# Altium schematic sheet Sheet1.SchDoc
size A3
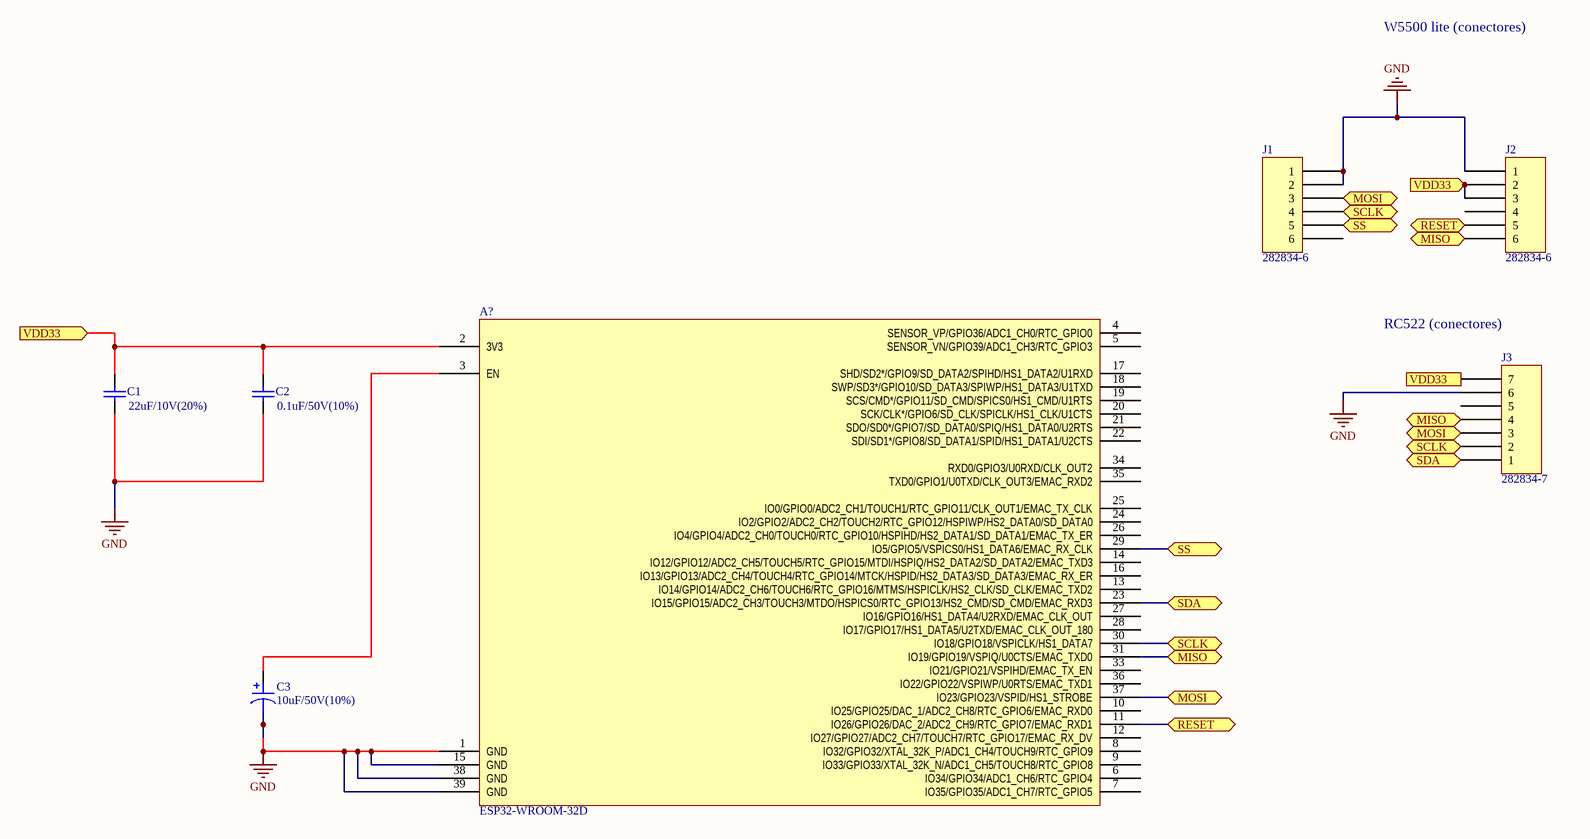
[diagram p0: Sheet1.SchDoc]

## Parts
A?  ESP32-WROOM-32D  [Espressif ESP32-WROOM-32]
C1  value 22uF/10V(20%)  [RAD-0.3]
C2  value 0.1uF/50V(10%)  [RAD-0.3]
C3  (no value)  [CAP POL 1411_3528]
J1  282834-6  [TE 282834-6]
J2  282834-6  [TE 282834-6]
J3  282834-7  [TE 282834-7]

## Ports
MISO (bidir), MOSI (bidir), RESET (bidir), SCLK (bidir), SDA (bidir), SS (bidir), VDD33 (in)

## Nets
GND: A?.1(GND) A?.15(GND) A?.38(GND) A?.39(GND) C1.1 C2.1 C3.2 J1.1 J1.2 J2.1 J3.6
MISO: A?.31(IO19/GPIO19/VSPIQ/U0CTS/EMAC_TXD0) J2.6 J3.4 ; port MISO
MOSI: A?.37(IO23/GPIO23/VSPID/HS1_STROBE) J1.3 J3.3 ; port MOSI
RESET: A?.11(IO26/GPIO26/DAC_2/ADC2_CH9/RTC_GPIO7/EMAC_RXD1) J2.5 ; port RESET
SCLK: A?.30(IO18/GPIO18/VSPICLK/HS1_DATA7) J1.4 J3.2 ; port SCLK
SDA: A?.23(IO15/GPIO15/ADC2_CH3/TOUCH3/MTDO/HSPICS0/RTC_GPIO13/HS2_CMD/SD_CMD/EMAC_RXD3) J3.1 ; port SDA
SS: A?.29(IO5/GPIO5/VSPICS0/HS1_DATA6/EMAC_RX_CLK) J1.5 ; port SS
VDD33: A?.2(3V3) C1.2 C2.2 J2.2 J2.3 J3.7 ; port VDD33
NetA?_3: A?.3(EN) C3.1

Not connected (* = marked no-connect by the designer): A? 4(SENSOR_VP/GPIO36/ADC1_CH0/RTC_GPIO0) 5(SENSOR_VN/GPIO39/ADC1_CH3/RTC_GPIO3) 6(IO34/GPIO34/ADC1_CH6/RTC_GPIO4) 7(IO35/GPIO35/ADC1_CH7/RTC_GPIO5) 8(IO32/GPIO32/XTAL_32K_P/ADC1_CH4/TOUCH9/RTC_GPIO9) 9(IO33/GPIO33/XTAL_32K_N/ADC1_CH5/TOUCH8/RTC_GPIO8) 10(IO25/GPIO25/DAC_1/ADC2_CH8/RTC_GPIO6/EMAC_RXD0) 12(IO27/GPIO27/ADC2_CH7/TOUCH7/RTC_GPIO17/EMAC_RX_DV) 13(IO14/GPIO14/ADC2_CH6/TOUCH6/RTC_GPIO16/MTMS/HSPICLK/HS2_CLK/SD_CLK/EMAC_TXD2) 14(IO12/GPIO12/ADC2_CH5/TOUCH5/RTC_GPIO15/MTDI/HSPIQ/HS2_DATA2/SD_DATA2/EMAC_TXD3) 16(IO13/GPIO13/ADC2_CH4/TOUCH4/RTC_GPIO14/MTCK/HSPID/HS2_DATA3/SD_DATA3/EMAC_RX_ER) 17(SHD/SD2*/GPIO9/SD_DATA2/SPIHD/HS1_DATA2/U1RXD) 18(SWP/SD3*/GPIO10/SD_DATA3/SPIWP/HS1_DATA3/U1TXD) 19(SCS/CMD*/GPIO11/SD_CMD/SPICS0/HS1_CMD/U1RTS) 20(SCK/CLK*/GPIO6/SD_CLK/SPICLK/HS1_CLK/U1CTS) 21(SDO/SD0*/GPIO7/SD_DATA0/SPIQ/HS1_DATA0/U2RTS) 22(SDI/SD1*/GPIO8/SD_DATA1/SPID/HS1_DATA1/U2CTS) 24(IO2/GPIO2/ADC2_CH2/TOUCH2/RTC_GPIO12/HSPIWP/HS2_DATA0/SD_DATA0) 25(IO0/GPIO0/ADC2_CH1/TOUCH1/RTC_GPIO11/CLK_OUT1/EMAC_TX_CLK) 26(IO4/GPIO4/ADC2_CH0/TOUCH0/RTC_GPIO10/HSPIHD/HS2_DATA1/SD_DATA1/EMAC_TX_ER) 27(IO16/GPIO16/HS1_DATA4/U2RXD/EMAC_CLK_OUT) 28(IO17/GPIO17/HS1_DATA5/U2TXD/EMAC_CLK_OUT_180) 33(IO21/GPIO21/VSPIHD/EMAC_TX_EN) 34(RXD0/GPIO3/U0RXD/CLK_OUT2) 35(TXD0/GPIO1/U0TXD/CLK_OUT3/EMAC_RXD2) 36(IO22/GPIO22/VSPIWP/U0RTS/EMAC_TXD1); J1 6; J2 4; J3 5

## Notes on the sheet
- W5500 lite (conectores)
- (near J3) RC522 (conectores)
- Title
- Size:
- Date:
- A3
- Number:
- Time:
- Revision:
- Sheet
- of
- File:
- (in symbol T55B337M2R5C0045) 10uF/50V(10%)

## Library data of the parts
A? = ESP32-WROOM-32D: WIFI MODULE 32MBITS SPI FLASH; Manufacturer: Espressif Systems; Utilized IC / Part: ESP32-D0WD; Antenna Type: Integrated, Trace; Data Rate: 150Mbps; Frequency: 2.4GHz ~ 2.5GHz; Memory Size: 448kB ROM, 536kB SRAM; Modulation: CCK, DSSS, OFDM; Power - Output: 20.5dBm; Protocol: 802.11b/g/n, Bluetooth v4.2 + EDR, Class 1, 2 and 3; RF Family/Standard: Bluetooth, WiFi; Sensitivity: -98dBm; Serial Interfaces: GPIO, I²C, I²S, PWM, SDIO, SPI, UART; Voltage - Supply: 2.7V ~ 3.6V; Part Number: ESP32-WROOM-32D; ComponentLink1Description: Datasheet; ComponentLink1URL: https://www.espressif.com/sites/default/files/documentation/esp32-wroom-32d_esp32-wroom-32u_datasheet_en.pdf; ComponentLink2Description: DigiKey Link; ComponentLink2URL: http://digikey.com/product-detail/en/espressif-systems/ESP32-WROOM-32D/1904-1023-1-ND/9381732; LastUpdated: 31/07/2020 15:42:37; Lifecycle Status: Active; Minimum Order: 1; Mounting Type: Surface Mount; Operating Temperature: -40°C ~ 85°C; Package / Case: 38-SMD Module; Packaging: TapeAndReel; Part Status: Active; Price: 3.80; Series: ESP32; Supplier 1: DigiKey; Supplier Part Number 1: 1904-1023-1-ND
C1 C2 = Cap: Capacitor; Published: 8-Jun-2000; LatestRevisionDate: 17-Jul-2002; LatestRevisionNote: Re-released for DXP Platform.; PackageReference: RAD-0.3; Publisher: Altium Limited; PackageDescription: Radial Cap, Thru-Hole; 2 Leads; 0.3 in Pin Spacing
C3 = T55B337M2R5C0045: CAP TANT POLY 330UF 2.5V 1411; Manufacturer: Vishay Sprague; Manufacturer Size Code: B; Capacitance: 330µF; ESR (Equivalent Series Resistance): 45mOhm @ 100kHz; Tolerance: ±20%; Type: Molded; Part Number: T55B337M2R5C0045; ComponentLink1Description: Datasheet; ComponentLink1URL: http://www.vishay.com/docs/40174/t55.pdf; ComponentLink2Description: DigiKey Link; ComponentLink2URL: http://digikey.com/product-detail/en/vishay-sprague/T55B337M2R5C0045/718-T55B337M2R5C0045CT-ND/10507076; Device Package: 1411 (3528 Metric); Features: General Purpose; Height - Seated (Max): 0.083" (2.10mm); LastUpdated: 02/09/2020 01:15:46; Lifecycle Status: Active; Minimum Order: 1; Mounting Type: Surface Mount; Operating Temperature: -55°C ~ 105°C; Package / Case: 1411 (3528 Metric); Packaging: TapeAndReel; PartId: 55; Part Status: Active; Price: 0.27; Series: vPolyTan™ T55; Size / Dimension: 0.138" L x 0.110" W (3.50mm x 2.80mm); Supplier 1: DigiKey; Supplier Part Number 1: 718-T55B337M2R5C0045CT-ND; Voltage - Rated: 2.5V
J1 J2 = 282834-6: TERM BLK 6P SIDE ENT 2.54MM PCB; Manufacturer: TE Connectivity AMP Connectors; Current: 10A; Mating Orientation: Horizontal with Board; Number of Levels: 1; Pitch: 0.100" (2.54mm); Positions Per Level: 6; Voltage: 150V; Wire Gauge: 16-30 AWG; Wire Termination: Screw - Rising Cage Clamp; Part Number: 282834-6; Color: Green; ComponentLink1Description: Datasheet; ComponentLink1URL: https://www.te.com/commerce/DocumentDelivery/DDEController?Action=srchrtrv&DocNm=282834&DocType=Customer+Drawing&DocLang=English; ComponentLink2Description: DigiKey Link; ComponentLink2URL: http://digikey.com/product-detail/en/te-connectivity-amp-connectors/282834-6/A98337-ND/1153267; LastUpdated: 15/01/2020 04:16:31; Lifecycle Status: Active; Minimum Order: 1; Mounting Type: Through Hole; Packaging: Bulk; Part Status: Active; Price: 4.72; Series: Buchanan; Supplier 1: DigiKey; Supplier Part Number 1: A98337-ND
J3 = 282834-7: TERM BLK 7P SIDE ENT 2.54MM PCB; Manufacturer: TE Connectivity AMP Connectors; Current: 10A; Mating Orientation: Horizontal with Board; Number of Levels: 1; Pitch: 0.100" (2.54mm); Positions Per Level: 7; Voltage: 150V; Wire Gauge: 16-30 AWG; Wire Termination: Screw - Rising Cage Clamp; Part Number: 282834-7; Color: Green; ComponentLink1Description: Datasheet; ComponentLink1URL: https://www.te.com/commerce/DocumentDelivery/DDEController?Action=srchrtrv&DocNm=282834&DocType=Customer+Drawing&DocLang=English; ComponentLink2Description: DigiKey Link; ComponentLink2URL: http://digikey.com/product-detail/en/te-connectivity-amp-connectors/282834-7/A135912-ND/1827297; LastUpdated: 15/01/2020 04:16:49; Lifecycle Status: Active; Minimum Order: 1; Mounting Type: Through Hole; Packaging: Bulk; Part Status: Active; Price: 6.61; Series: Buchanan; Supplier 1: DigiKey; Supplier Part Number 1: A135912-ND